# Altium schematic sheet Sheet1.SchDoc: EM411-PROJ001
size A3; Date: March-25-2021; DrawnBy: Gaurav Daura; SheetNumber: 1; SheetTotal: 3
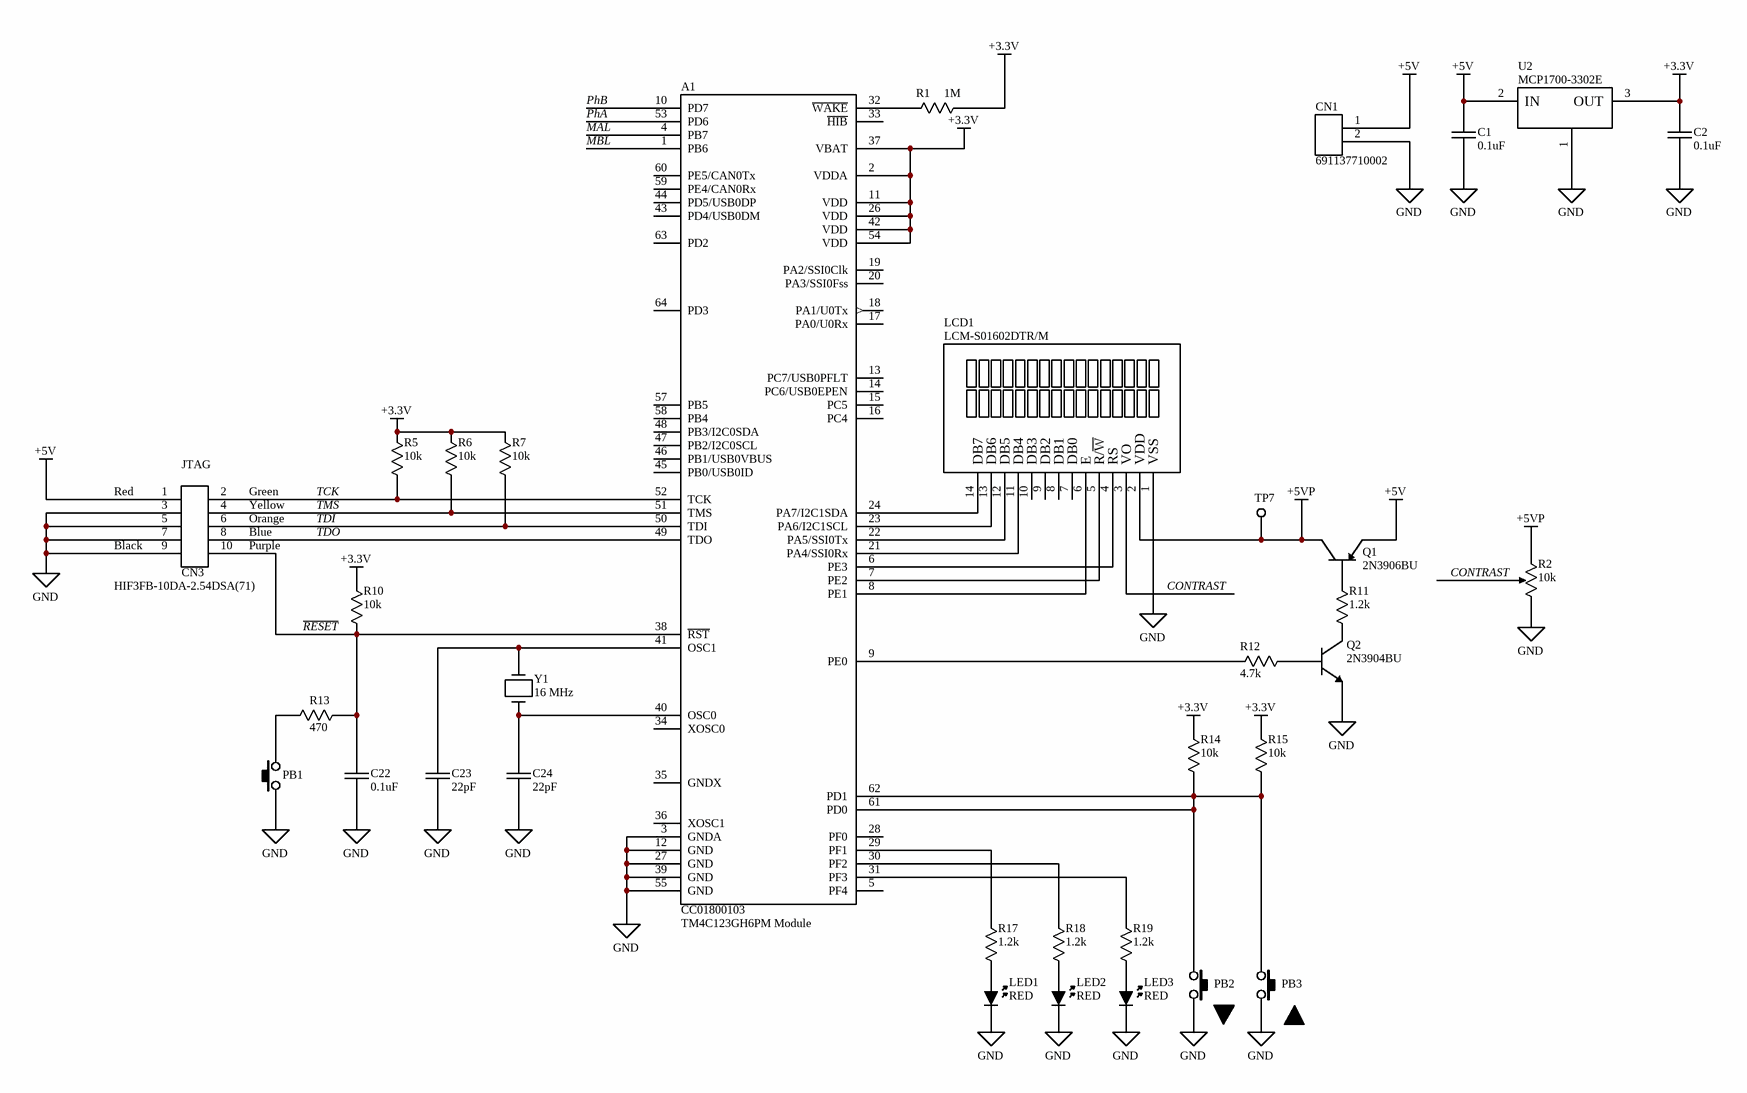
[diagram p0: Sheet1.SchDoc]

## Parts
A1  CC01800103  Microcontroller: TM4C123GH6PM Module  [CC01800102]
C1  0.1uF  [C320C104M5R5TA]
C2  0.1uF  [C320C104M5R5TA]
C22  0.1uF  [C320C104M5R5TA]
C23  22pF  [K220J15C0GF5TH5]
C24  22pF  [K220J15C0GF5TH5]
CN1  691137710002  [691137710002]
CN3  HIF3FB-10DA-2.54DSA(71)  [HIF3FB-10DA-2.54DSA(71)]
LCD1  LCM-S01602DTR/M  [LCM-S01602DTR/M]
LED1  RED  [C503B-RCN-CW0Z0AA1]
LED2  RED  [C503B-RCN-CW0Z0AA1]
LED3  RED  [C503B-RCN-CW0Z0AA1]
PB1  3-1825910-5  [3-1825910-5]  (value not drawn)
PB2  3-1825910-5  [3-1825910-5]  (value not drawn)
PB3  3-1825910-5  [3-1825910-5]  (value not drawn)
Q1  2N3906BU  [2N3906BU]
Q2  2N3904BU  [2N3904BU]
R1  1M  [1/2WattResistor]
R2  10k  [T93YA103KT20]
R5  10k  [1/2WattResistor]
R6  10k  [1/2WattResistor]
R7  10k  [1/2WattResistor]
R10  10k  [1/2WattResistor]
R11  1.2k  [1/2WattResistor]
R12  4.7k  [1/2WattResistor]
R13  470  [1/2WattResistor]
R14  10k  [1/2WattResistor]
R15  10k  [1/2WattResistor]
R17  1.2k  [1/2WattResistor]
R18  1.2k  [1/2WattResistor]
R19  1.2k  [1/2WattResistor]
TP7  TESTPOINT-2MM  [TESTPOINT-2MM]  (value not drawn)  (no BOM)
U2  MCP1700-3302E  [MCP1700-3302E/TO]
Y1  16 MHz  [ABL-16.000MHZ-B2]

## Nets
+3.3V: A1.2(VDDA) A1.11(VDD) A1.26(VDD) A1.37(VBAT) A1.42(VDD) A1.54(VDD) C2.2 R1.2 R5.2 R6.2 R7.2 R10.2 R14.2 R15.2 U2.3(OUT)
+5V: C1.2 CN1.1 CN3.1 Q1.1(E) U2.2(IN)
+5VP: LCD1.2(VDD) Q1.3(C) R2.1 TP7.1
GND: A1.3(GNDA) A1.12(GND) A1.27(GND) A1.39(GND) A1.55(GND) C1.1 C2.1 C22.2 C23.2 C24.2 CN1.2 CN3.3 CN3.5 CN3.7 CN3.9 LCD1.1(VSS) LED1.K LED2.K LED3.K PB1.1 PB2.2 PB3.2 Q2.1(E) R2.3 U2.1(GND)
CONTRAST: LCD1.3(VO) R2.2
MAL: A1.4(PB7)
MBL: A1.1(PB6)
PhA: A1.53(PD6)
PhB: A1.10(PD7)
~{RESET}: A1.38(~{RST}) C22.1 CN3.10 R10.1 R13.2
TCK: A1.52(TCK) CN3.2 R5.1
TDI: A1.50(TDI) CN3.6 R7.1
TDO: A1.49(TDO) CN3.8
TMS: A1.51(TMS) CN3.4 R6.1
NetA1_6: A1.6(PE3) LCD1.4(RS)
NetA1_7: A1.7(PE2) LCD1.5(R/~{W})
NetA1_8: A1.8(PE1) LCD1.6(E)
NetA1_9: A1.9(PE0) R12.1
NetA1_21: A1.21(PA4/SSI0Rx) LCD1.11(DB4)
NetA1_22: A1.22(PA5/SSI0Tx) LCD1.12(DB5)
NetA1_23: A1.23(PA6/I2C1SCL) LCD1.13(DB6)
NetA1_24: A1.24(PA7/I2C1SDA) LCD1.14(DB7)
NetA1_29: A1.29(PF1) R17.2
NetA1_30: A1.30(PF2) R18.2
NetA1_31: A1.31(PF3) R19.2
NetA1_32: A1.32(~{WAKE}) R1.1
NetA1_40: A1.40(OSC0) C24.1 Y1.1
NetA1_41: A1.41(OSC1) C23.1 Y1.2
NetA1_61: A1.61(PD0) A1.62(PD1) PB2.1 PB3.1 R14.1 R15.1
NetLED1_A: LED1.A R17.1
NetLED2_A: LED2.A R18.1
NetLED3_A: LED3.A R19.1
NetPB1_2: PB1.2 R13.1
NetQ1_2: Q1.2(B) R11.2
NetQ2_2: Q2.2(B) R12.2
NetQ2_3: Q2.3(C) R11.1

Not connected (* = marked no-connect by the designer): A1 5(PF4) 13(PC7/USB0PFLT) 14(PC6/USB0EPEN) 15(PC5) 16(PC4) 17(PA0/U0Rx) 18(PA1/U0Tx) 19(PA2/SSI0Clk) 20(PA3/SSI0Fss) 28(PF0) 33(~{HIB}) 34(XOSC0) 35(GNDX) 36(XOSC1) 43(PD4/USB0DM) 44(PD5/USB0DP) 45(PB0/USB0ID) 46(PB1/USB0VBUS) 47(PB2/I2C0SCL) 48(PB3/I2C0SDA) 57(PB5) 58(PB4) 59(PE4/CAN0Rx) 60(PE5/CAN0Tx) 63(PD2) 64(PD3); LCD1 7(DB0) 8(DB1) 9(DB2) 10(DB3)

## Notes on the sheet
- (near CN3) Red
- (near CN3) JTAG
- (near CN3) Green
- (near CN3) Black
- (near CN3) Yellow
- (near CN3) Orange
- (near CN3) Blue
- (near CN3) Purple
- Course
- EM 411 Embedded Systems Design
- Title
- Date
- Sheet
- of
- File
- Drawn by

## Library data of the parts
A1 = CC01800103: Tiva TM4C123GH6PM Microcontroller Module; Manufacturer: Confederation College; PartNumber: CC01800103
C1 C2 C22 = C320C104M5R5TA: 0.1 uF, 50 V Ceramic Capacitor; Manufacturer: Kemet; PartNumber: C320C104M5R5TA
C23 C24 = K220J15C0GF5TH5: 22 pF, 50 V Ceramic Capacitor; Manufacturer: Vishay; PartNumber: K220J15C0GF5TH5
CN1 = 691137710002: TERM BLK 2POS SIDE ENTRY 5MM PCB; Manufacturer: Wurth Elektronk; PartNumber: 691137710002
CN3 = HIF3FB-10DA-2.54DSA(71): CONN RCPT 10POS 0.1 GOLD PCB; Manufacturer: Hirose Electric Co, Ltd; PartNumber: HIF3FB-10DA-2.54DSA(71)
LCD1 = LCM-S01602DTR/M: 16x2 Character LCD Module, TN, Reflective; Manufacturer: Lumex, Inc.; PartNumber: LCM-S01602DTR/M
LED1-LED3 = C503B-RCN-CW0Z0AA1: 5 mm Red Round LED; Manufacturer: Cree, Inc.; PartNumber: C503B-RCN-CW0Z0AA1; Value: RED
PB1-PB3 = 3-1825910-5: SWITCH TACTILE SPST-NO 0.05A 24V; Manufacturer: TE Connectivity ALCOSWITCH Switches; PartNumber: 3-1825910-5
Q1 = 2N3906BU: PNP General Purpose Amplifier; Manufacturer: Fairchild Semiconductor Corporation; PartNumber: 2N3906BU; Value: PNP
Q2 = 2N3904BU: NPN General Purpose Amplifier; Manufacturer: Fairchild Semiconductor Corporation; PartNumber: 2N3904BU; Value: NPN
R1 = RES1M-500mW-THRU-HOLE: 1 Mega Ohm, ±5%, 0.5W Thru-Hole Resistor; Manufacturer: Generic; PartNumber: RES1k2-500mW-THRU-HOLE; Value: 1M
R2 = T93YA103KT20: 10 k, 21-Turn Trimmer; Manufacturer: Vishay Sfernice; PartNumber: T93YA103KT20; Value: 10k
R5-R7 R10 R14 R15 = RES10k-500mW-THRU-HOLE: 10k, ±5%, 0.5W Thru-Hole Resistor; Manufacturer: Generic; PartNumber: RES10k-500mW-THRU-HOLE; Value: 10k
R11 R17-R19 = RES1k2-500mW-THRU-HOLE: 1.2k, ±5%, 0.5W Thru-Hole Resistor; Manufacturer: Generic; PartNumber: RES1k2-500mW-THRU-HOLE; Value: 1.2k
R12 = RES4k7-500mW-THRU-HOLE: 4.7 kOhm, ±5%, 0.5W Thru-Hole Resistor; Manufacturer: Generic; PartNumber: RES4k7-500mW-THRU-HOLE; Value: 4.7k
R13 = RES470-500mW-THRU-HOLE: 470 Ohm, ±5%, 0.5W Thru-Hole Resistor; Manufacturer: Generic; PartNumber: RES470-500mW-THRU-HOLE; Value: 470
TP7 = TESTPOINT-2MM: Test Point 2MM diameter; Manufacturer: -; PartNumber: -
U2 = MCP1700-3302E: Low Quiescent Current LDO; Manufacturer: Microchip Technology; PartNumber: MCP1700-3302E
Y1 = ABL-16.000MHZ-B2: 16 MHz AC/49US (AT49) Microprocessor Crystall; Manufacturer: Abracon Corporation; PartNumber: ABL-16.000MHZ-B2